# EAGLE design flowerfriend_rev3 (EAGLE 7.2.0)
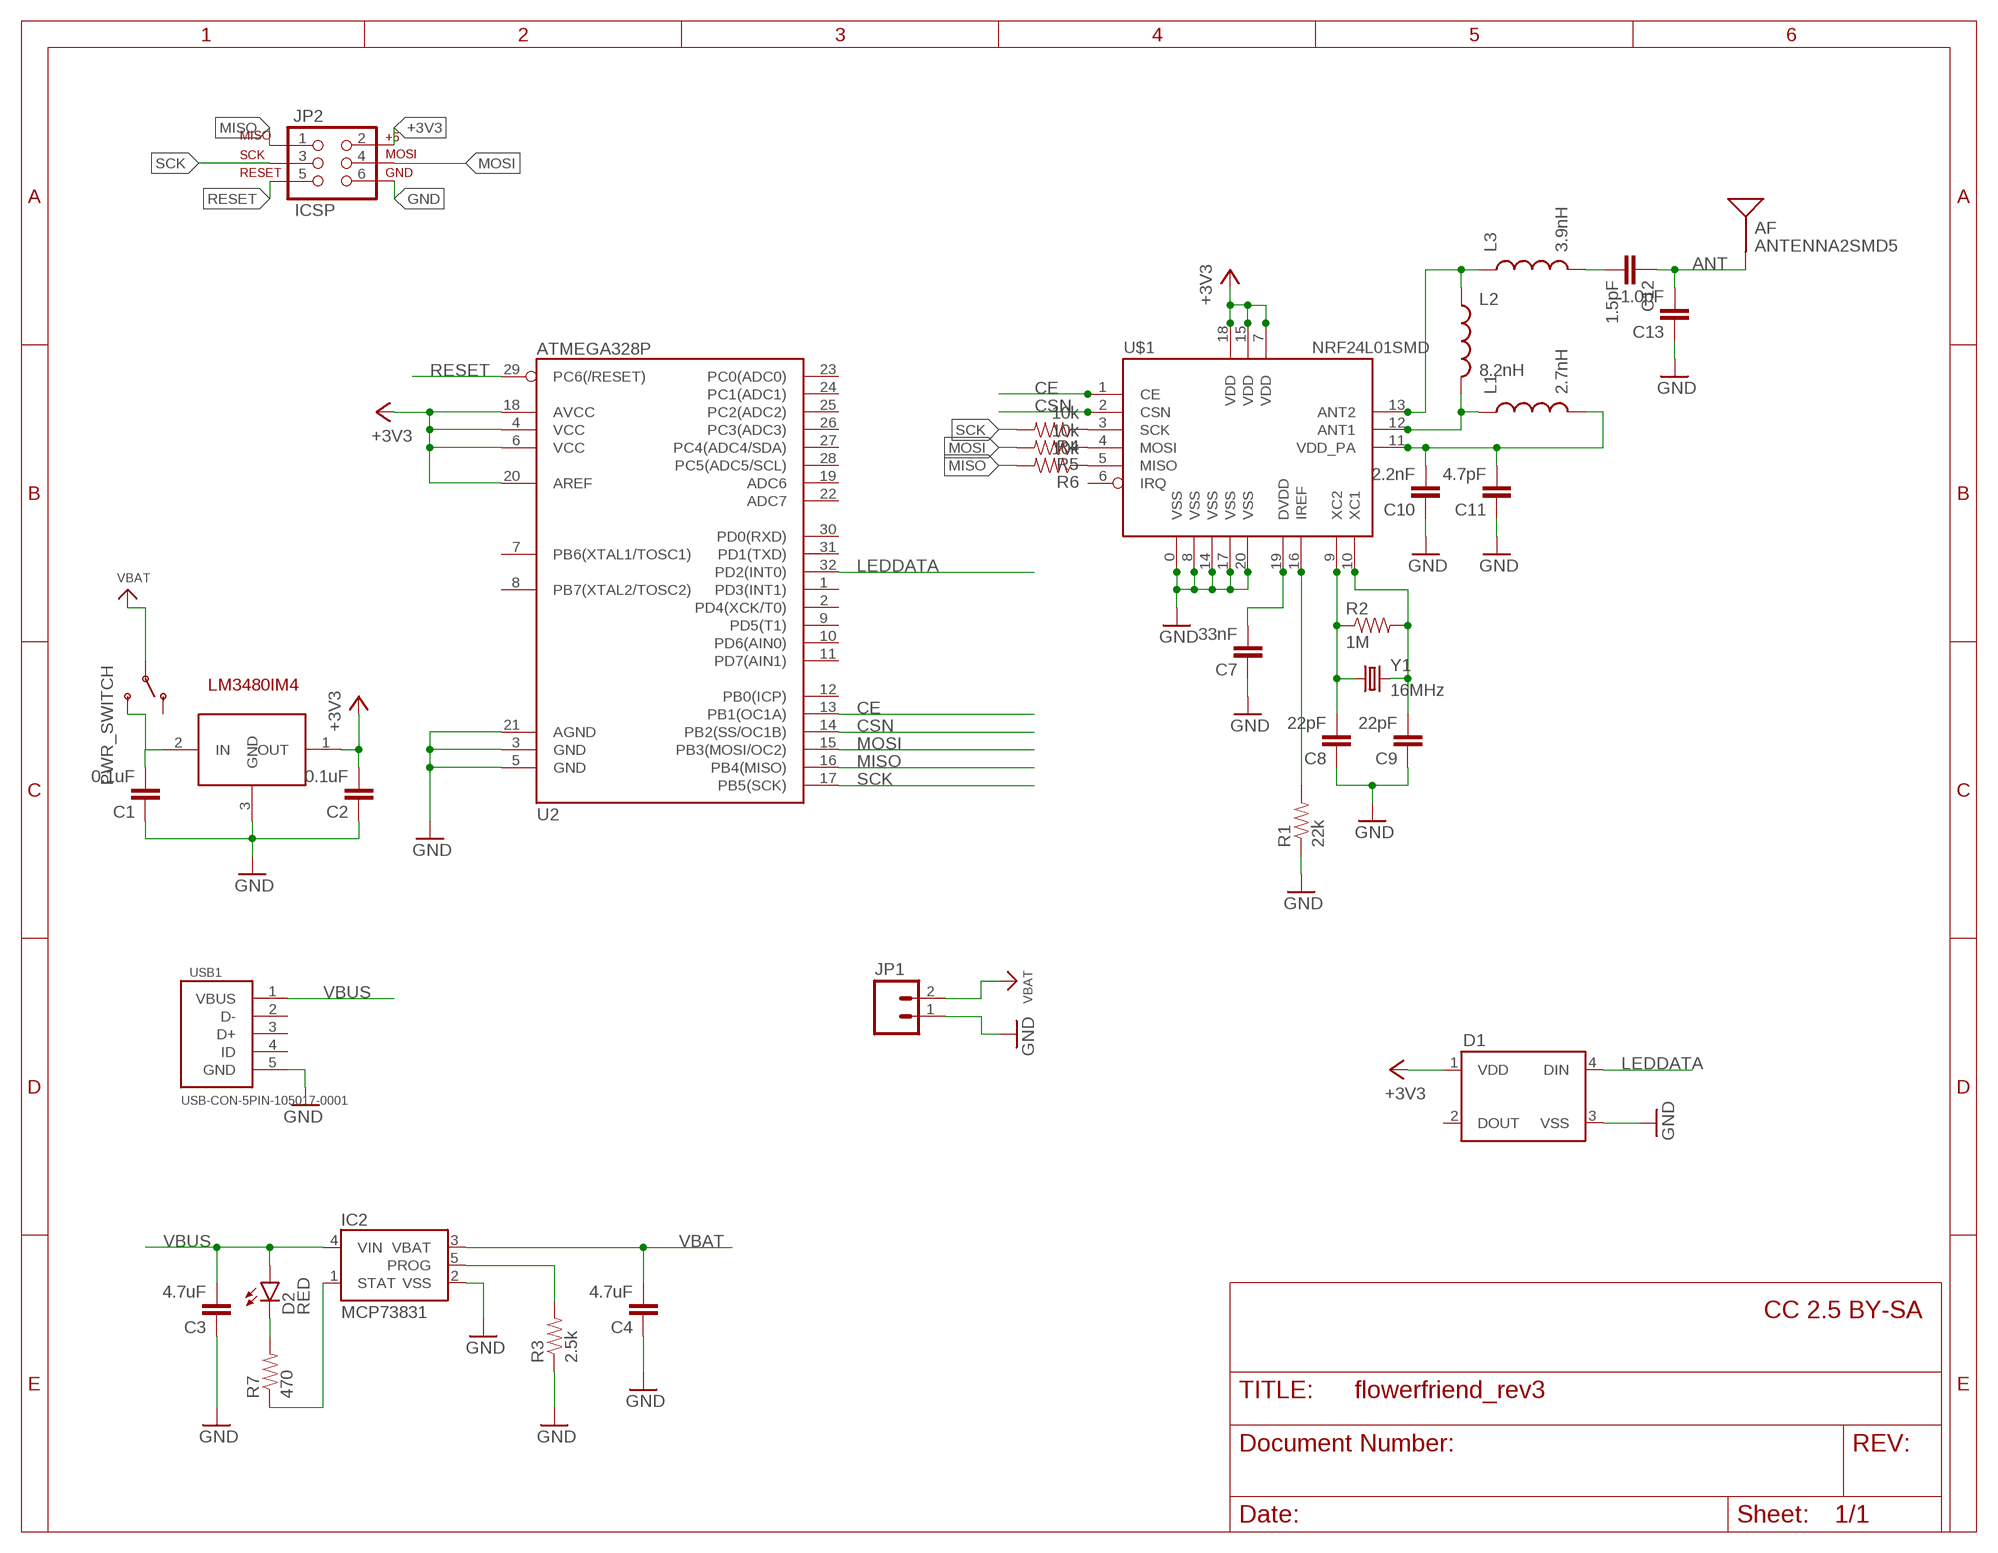
[diagram p0: schematic, sheet 1]

## Parts
AF  ANTENNA2SMD5  [ANTENNA-CHIP5]
C1  0.1uF  CAP0805  [0805]
C2  0.1uF  CAP0805  [0805]
C3  4.7uF  CAP0805  [0805]
C4  4.7uF  CAP0805  [0805]
C7  33nF  CAP0805  [0805]
C8  22pF  CAP0805  [0805]
C9  22pF  CAP0805  [0805]
C10  2.2nF  CAP0805  [0805]
C11  4.7pF  CAP0805  [0805]
C12  1.5pF  CAP0805  [0805]
C13  1.0pF  CAP0805  [0805]
D1  WS2812B  [WS2812B]
D2  RED  LED-RED0603  [LED-0603]
IC1  LM3480IM4  [SOT23-3]
IC2  MCP73831  [SOT23-5]
JP1  M02PTH  [1X02]
JP2  ICSP  AVR_SPI_PRG_6PTH  [2X3]
L1  2.7nH  INDUCTOR0805  [0805]
L2  8.2nH  INDUCTOR0805  [0805]
L3  3.9nH  INDUCTOR0805  [0805]
PWR_SWITCH  SWITCH_SPDT  [KPS-1290]
R1  22k  RESISTOR0805-RES  [0805]
R2  1M  RESISTOR0805-RES  [0805]
R3  2.5k  RESISTOR0805-RES  [0805]
R4  10k  RESISTOR0805-RES  [0805]
R5  10k  RESISTOR0805-RES  [0805]
R6  10k  RESISTOR0805-RES  [0805]
R7  470  RESISTOR0805-RES  [0805]
U2  ATMEGA328P  ATMEGA328_SMT  [TQFP32-08]
U$1  NRF24L01SMD  [QFN20]
USB1  USB-CON-5PIN-105017-0001  [USB-MICRO-MOLEX-105017-0001]
Y1  16MHz  CRYSTAL5X3  [CRYSTAL-SMD-5X3]

## Nets
+3V3 [power]: C2.2 D1.1(VDD) IC1.1(OUT) JP2.2 U2.4(VCC) U2.6(VCC) U2.18(AVCC) U2.20(AREF) U$1.7(VDD) U$1.15(VDD) U$1.18(VDD)
ANT: AF.FEED(SIGNAL) C12.1 C13.2
CE: U2.13(PB1(OC1A)) U$1.1(CE)
CSN: U2.14(PB2(SS/OC1B)) U$1.2(CSN)
GND [power]: C1.1 C2.1 C3.1 C4.1 C7.1 C8.1 C9.1 C10.1 C11.1 C13.1 D1.3(VSS) IC1.3(GND) IC2.2(VSS) JP1.1 JP2.6 R1.1 R3.1 U2.3(GND) U2.5(GND) U2.21(AGND) U$1.0(VSS) U$1.8(VSS) U$1.14(VSS) U$1.17(VSS) U$1.20(VSS) USB1.5(GND)
LEDDATA: D1.4(DIN) U2.32(PD2(INT0))
MISO: JP2.1 R6.2 U2.16(PB4(MISO))
MOSI: JP2.4 R5.2 U2.15(PB3(MOSI/OC2))
N$1: IC2.5(PROG) R3.2
N$4: C8.2 R2.1 U$1.9(XC2) Y1.1
N$5: C9.2 R2.2 U$1.10(XC1) Y1.3
N$6: R4.1 U$1.3(SCK)
N$7: R5.1 U$1.4(MOSI)
N$8: L2.1 L3.1 U$1.13(ANT2)
N$9: C10.2 C11.2 L1.2 U$1.11(VDD_PA)
N$10: R1.2 U$1.16(IREF)
N$11: C7.2 U$1.19(DVDD)
N$12: L1.1 L2.2 U$1.12(ANT1)
N$13: C12.2 L3.2
N$14: R6.1 U$1.5(MISO)
N$15 [power]: C1.2 IC1.2(IN) PWR_SWITCH.S
N$16: D2.C R7.2
N$17: IC2.1(STAT) R7.1
RESET: JP2.5 U2.29(PC6(/RESET))
SCK: JP2.3 R4.2 U2.17(PB5(SCK))
VBAT [power]: C4.2 IC2.3(VBAT) JP1.2 PWR_SWITCH.P
VBUS: C3.2 D2.A IC2.4(VIN) USB1.1(VBUS)
Unconnected: D1.2(DOUT) PWR_SWITCH.O U2.1(PD3(INT1)) U2.2(PD4(XCK/T0)) U2.7(PB6(XTAL1/TOSC1)) U2.8(PB7(XTAL2/TOSC2)) U2.9(PD5(T1)) U2.10(PD6(AIN0)) U2.11(PD7(AIN1)) U2.12(PB0(ICP)) U2.19(ADC6) U2.22(ADC7) U2.23(PC0(ADC0)) U2.24(PC1(ADC1)) U2.25(PC2(ADC2)) U2.26(PC3(ADC3)) U2.27(PC4(ADC4/SDA)) U2.28(PC5(ADC5/SCL)) U2.30(PD0(RXD)) U2.31(PD1(TXD)) U$1.6(IRQ) USB1.2(D-) USB1.3(D+) USB1.4(ID)

## Notes on the sheet
- CC 2.5 BY-SA

## Library data of the parts
AF = SparkFun-RF:ANTENNA2: Chip antenna Single endded antenna. Common with smaller chip antennas. CHIP4 package is the GPS Chip Antenna SKU: GPS-08418. CHIP5 package is 2.4GHz chip antenna SKU: WRL-00144.
C1-C4 C7-C13 = SparkFun-Passives:CAP: Capacitor Standard 0603 ceramic capacitor, and 0.1" leaded capacitor.
D1 = SparkFun-LED:WS2812B: WS2812B - Intelligent control LED integrated light source Technical Specifications: Power Supply Voltage (VDD): 3.5 to 5.3 V Input Voltage (VI): -0.5 to VDD+0.5 V Operating Junction Temperature (Topt): -25°C to +80°C Storage Temperature Range (Tstg): -55°C to +150°C; PROD_ID: DIO-12503
D2 = SparkFun-LED:LED-RED: Assorted Red LEDs LilyPad 1206- DIO-09912 1206- DIO-00809 0603- DIO-00819 "SMART" means more efficient and expensive; PROD_ID: DIO-00819
IC1 = SparkFun-PowerIC:LM3480IM4: Small package linear regulator
IC2 = SparkFun-PowerIC:MCP73831: Miniature single cell, fully integrated Li-Ion, Li-polymer charge management controller http://ww1.microchip.com/downloads/en/DeviceDoc/20001984g.pdf IC-09995; PROD_ID: IC-09995
JP1 = SparkFun-Connectors:M02: Standard 2-pin 0.1" header. Use with - straight break away headers ( PRT-00116) - right angle break away headers (PRT-00553) - swiss pins (PRT-00743) - machine pins (PRT-00117) - female headers (PRT-00115) Molex polarized connector foot print use with: PRT-08233 with associated crimp pins and housings. 2.54_SCREWTERM for use with PRT-10571. 3.5mm Screw Terminal footprints for PRT-08084 5mm Screw Terminal footprints for use with PRT-08432
JP2 = SparkFun-Connectors:AVR_SPI_PRG_6: AVR ISP 6 Pin This is the reduced ISP connector for AVR programming. Common on Arduino. This footprint will take up less PCB space and can be used with a 10-pin to 6-pin adapter such as SKU: BOB-08508 **Special note about "TEST_POINT" package. The stop mask is on the top side, so if you want your programming test points to be on the bottom of your board, make sure to place this package on the bottom side of the board. This also ensure that the orientation to program from the bottom side will be correct.
L1-L3 = SparkFun-Passives:INDUCTOR: Inductors Basic Inductor/Choke - 0603 and 1206. Footprints are not proven and vary greatly between part numbers. SRN6045- 33uH, 20% 1.4A SDR0403-560KL - 56uH, 10%, 500mA RMS/740mA peak
PWR_SWITCH = SparkFun-Electromechanical:SWITCH_SPDT: SWCH-10651 Side-actuated SPDT slide switch, as used on the Arduino Pro; PROD_ID: SWCH-10651
R1-R7 = SparkFun-Passives:RESISTOR: Resistor Basic schematic elements and footprints for 0603, 1206, and PTH resistors.
U2 = SparkFun-DigitalIC:ATMEGA328_SMT: 32-Pin Atmega328 part Commonly used on Arduino compatible boards Available in QFP and QFN packages TQFP is IC-09069 QFN is non-stock; PROD_ID: IC-09069
U$1 = SparkFun-RF:NRF24L01: 2.4GHz Low Power Transceiver This is the very popular, low cost, very low power RF transceiver from Nordic Semiconductor. Simple SPI interface. SKU: COM-00690
USB1 = GeekAmmo:USB-CON-5PIN: Molex Micro USB 105017-0001
Y1 = SparkFun-FreqCtrl:CRYSTAL: Various standard crystals. Proven footprints.; PROD_ID: XTAL-08218

## Net classes
1 power: width 0.305 mm

## Board
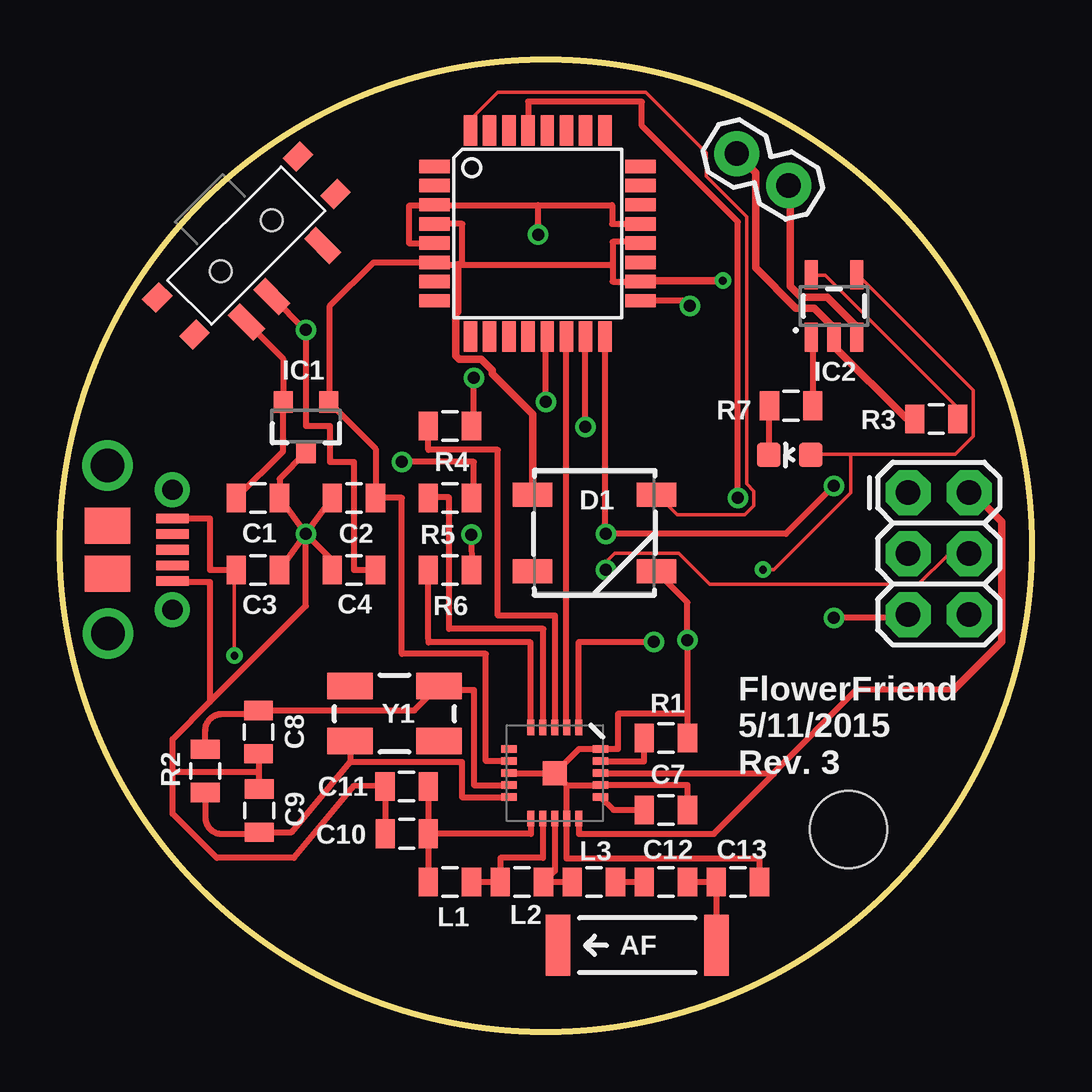
[diagram p1: board, top side]
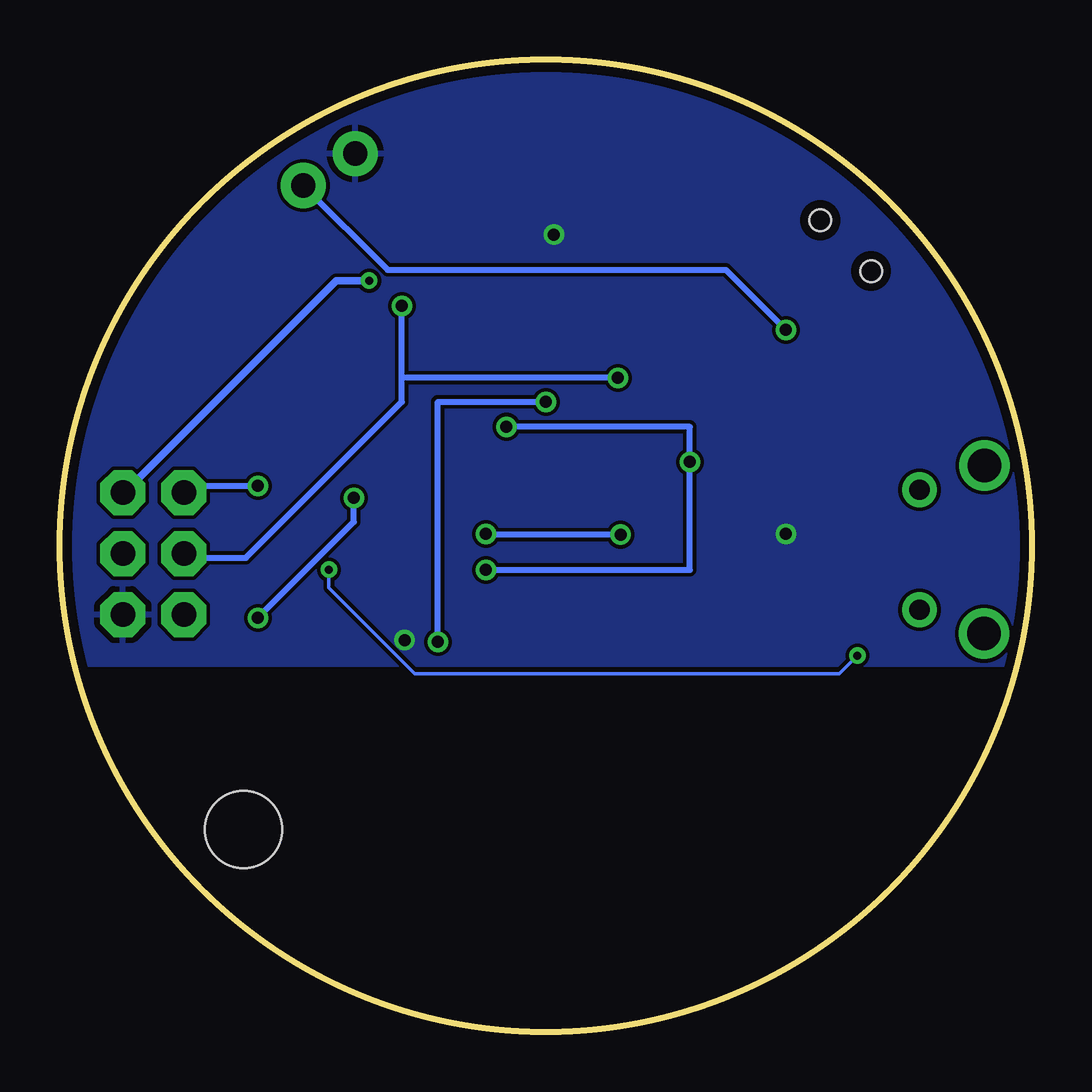
[diagram p2: board, bottom side, seen from below]

Size 40.5 x 40.5 mm. Coordinates in mm from the lower left corner, seen from the top.
Outline: circle at 20.25,20.25 radius 20.25
Copper layers (1*16): Top 0.0356mm / dielectric 1.5011mm / Bottom 0.0356mm
Design rules "LaenPCBOrder *": minimum track width 6mil, minimum drill 13mil, track to track 6mil, track to pad 6mil, pad to pad 6mil, via to via 6mil, smd to smd 6mil, copper to edge 15mil, drill to drill 6mil, minimum pad ring 7mil, minimum via ring 7mil, stop-mask expansion 3mil, vias tented up to drill 0mil, thermal gap 10mil
Holes 3.2 mm at 32.85,8.43

### Footprints (pad centres in the part's own frame; a part is rotated, then mirrored left to right if it is on the bottom)
ANTENNA-CHIP5 = smd 1.016 x 2.54: FEED -3.302,0; NC 3.302,0
0805 = smd 0.8 x 1.2: 1 -0.9,0; 2 0.9,0
WS2812B = smd 1.651 x 1: 1 -2.577,1.6; 2 -2.577,-1.6; 3 2.577,-1.6; 4 2.577,1.6
LED-0603 = smd 1 x 1: A 0,-0.877; C 0,0.877
SOT23-3 = smd 0.8 x 0.9: 1 -0.95,-1; 2 0.95,-1; 3 0,1.1
SOT23-5 = smd 0.55 x 1.2: 1 -0.95,-1.3; 2 0,-1.3; 3 0.95,-1.3; 4 0.95,1.3; 5 -0.95,1.3
1X02 = drill 1.016 pad 1.88: 1 0,0; 2 2.54,0
2X3 = drill 1.016 pad 1.88 octagon: 1 0,0; 2 0,2.54; 3 2.54,0; 4 2.54,2.54; 5 5.08,0; 6 5.08,2.54
KPS-1290 = smd 0.7 x 1.5: O -2.25,2.25; P 0.75,2.25; S 2.25,2.25 | smd 1 x 0.8: P$1 -4.15,1.1; P$2 -4.15,-1.1; P$3 4.15,-1.1; P$4 4.15,1.1 | hole 0.9: -1.5,0; 1.5,0
TQFP32-08 = smd 1.27 x 0.559: 1 -4.293,2.8; 2 -4.293,2; 3 -4.293,1.2; 4 -4.293,0.4; 5 -4.293,-0.4; 6 -4.293,-1.2; 7 -4.293,-2; 8 -4.293,-2.8; 17 4.293,-2.8; 18 4.293,-2; 19 4.293,-1.2; 20 4.293,-0.4; 21 4.293,0.4; 22 4.293,1.2; 23 4.293,2; 24 4.293,2.8 | smd 0.559 x 1.27: 9 -2.8,-4.293; 10 -2,-4.293; 11 -1.2,-4.293; 12 -0.4,-4.293; 13 0.4,-4.293; 14 1.2,-4.293; 15 2,-4.293; 16 2.8,-4.293; 25 2.8,4.293; 26 2,4.293; 27 1.2,4.293; 28 0.4,4.293; 29 -0.4,4.293; 30 -1.2,4.293; 31 -2,4.293; 32 -2.8,4.293
QFN20 = smd 1 x 1: 0 0,0 | smd 0.65 x 0.3: 1 -1.9,1; 2 -1.9,0.5; 3 -1.9,0; 4 -1.9,-0.5; 5 -1.9,-1; 11 1.9,-1; 12 1.9,-0.5; 13 1.9,0; 14 1.9,0.5; 15 1.9,1 | smd 0.3 x 0.65: 6 -1,-1.9; 7 -0.5,-1.9; 8 0,-1.9; 9 0.5,-1.9; 10 1,-1.9; 16 1,1.9; 17 0.5,1.9; 18 0,1.9; 19 -0.5,1.9; 20 -1,1.9
USB-MICRO-MOLEX-105017-0001 = smd 0.4 x 1.35: 1 1.2,0; 2 1.85,0; 3 2.5,0; 4 3.15,0; 5 3.8,0 | drill 0.85 pad 1.45: P$1 0,0; P$2 5,0 | smd 1.5 x 1.9: P$3 3.5,-2.7; P$4 1.5,-2.7 | drill 1.4: P$5 -1.004,-2.701; P$6 5.999,-2.69
CRYSTAL-SMD-5X3 = smd 1.9 x 1.1: 1 -1.85,-1.15; 2 1.85,-1.15; 3 1.85,1.15; 4 -1.85,1.15

### Placement (x,y rotation side)
AF  24.05,3.61 180 top
C1  8.25,22.25 180 top
C2  12.25,22.25 0 top
C3  8.25,19.25 180 top
C4  12.25,19.25 0 top
C7  25.25,12.25 180 top
C8  8.27,12.49 90 top
C9  8.3,9.22 270 top
C10  14.45,8.26 0 top
C11  14.45,10.23 0 top
C12  25.25,6.25 180 top
C13  28.25,6.25 180 top
D1  22.27,20.79 0 top
D2  30.41,24.04 90 top
IC1  10.25,25.25 180 top
IC2  32.25,30.25 0 top
JP1  28.2,36.6 328.4 top
JP2  35.34,22.47 270 top
L1  16.25,6.25 180 top
L2  19.25,6.25 180 top
L3  22.25,6.25 0 top
PWR_SWITCH  7.76,32.76 225 top
R1  25.25,9.25 180 top
R2  6.06,10.87 270 top
R3  36.51,25.54 0 top
R4  16.25,25.25 0 top
R5  16.25,22.25 0 top
R6  16.25,19.25 0 top
R7  30.46,26.09 180 top
U2  19.9,33.27 0 top
U$1  20.61,10.79 270 top
USB1  4.68,22.59 270 top
Y1  13.94,13.26 180 top

### Tracks (layer width: path | path; a pad name or v marks a point on that pad's centre or on a via)
+3V3  (via drill 0.33)
  Top 0.254: U$1.15 21.61,8.25 27.25,8.25 29.75,10.75 29.71,10.79 | U$1.18 29.71,10.79 | U$1.7 17.75,11.29 17.75,15.75 14.25,15.75 14.25,22.25 C2.2 13.15,24.3 IC1.1 11.25,26.3 11.25,30.25 13.07,32.07 U2.6 15.61,31.97 16.57,31.97 16.76,31.97 | 16.76,31.97 16.76,33.67 U2.4 | U2.20 24.19,32.92 23.03,32.92 23.03,31.97 | 23.03,31.97 23.03,31.27 U2.18 | 16.76,31.97 23.03,31.97 | 37.25,14.25 33.17,14.25 29.71,10.79
  Top 0.305: 16.57,31.97 16.57,30.01 16.49,29.93 16.49,28.18 16.64,28.02 17.56,28.02 18.01,27.57 18.01,27.42 19.69,25.74 19.69,22.46 D1.1 | v27.62,31.3 24.26,31.3 U2.18 | 37.25,14.25 39.25,16.25 39.25,21.25 38.25,22.25 JP2.2
  Bottom 0.305: v27.62,31.3 28.99,31.3 37.83,22.46 JP2.2
ANT
  Top 0.254: C12.1 C13.2 AF.FEED
CE  (via drill 0.5 pad 0.25)
  Top 0.254: U$1.1 21.61,16.25 v24.75,16.25 | v20.25,26.25 20.25,28.97 U2.13
  Bottom 0.254: v24.75,16.25 24.75,26.25 v20.25,26.25
CSN
  Top 0.254: U$1.2 21.1,12.7 U2.14
GND  (via drill 0.5 pad 0.25)
  Top 0.254: 21.11,10.29 U$1.14 21.11,7.22 29.15,7.22 C13.1 | U$1.8 U$1.0 | U$1.0 21.11,10.29 | 21.11,10.29 U$1.17 26.15,10.29 R1.1 | U$1.0 21.61,11.79 U$1.20 23.25,11.79 23.25,13.25 26.15,13.25 | C10.1 C11.1 12.25,10.25 9.75,7.25 6.54,7.25 4.69,9.09 4.69,10.82 | C7.1 26.15,13.25 | 26.15,13.25 26.15,16.32 v26.14,16.33 26.14,17.9 D1.3 | C8.1 8.3,11.59 C9.1 8.3,10.82 4.69,10.82 | 4.69,10.82 4.69,12.19 6.25,13.75 | 6.25,13.75 10.25,17.75 v10.25,20.75 | 19.92,34.45 15.62,34.45 U2.3 15.61,34.42 14.54,34.42 14.54,32.87 U2.5 | 19.92,34.45 23.01,34.45 23.01,33.67 U2.21 | USB1.5 4.68,18.75 6.25,18.75 6.25,13.75 | C2.1 v10.25,20.75 | v10.25,20.75 C1.1 9.15,23.05 IC1.3 | C3.1 v10.25,20.75 | v10.25,20.75 11.35,19.65 C4.1 | v19.92,33.22 19.92,34.45
  Top 0.305: R3.1 35.54,25.59 35.24,25.59 32.26,28.56 32.26,28.94 IC2.2 32.26,29.09 32.26,29.32 31.43,30.16 30.66,30.16 28.99,31.83 28.99,35.8 28.23,36.56 JP1.1
  pour Bottom: 41.25,15.25 -0.75,15.25 -0.75,41.25 41.25,41.25
LEDDATA
  Top 0.152: U2.32 17.18,37.63 17.18,38.08 18.24,39.15 24.42,39.15 26.93,36.64 26.93,35.64 28.61,33.97 28.61,22.84 28.91,22.54 28.91,21.93 28.53,21.55 25.71,21.55 24.87,22.39 D1.4
MISO  (via drill 0.5 pad 0.25)
  Top 0.254: U2.16 22.7,20.75 v22.75,20.75 30.25,20.75 v32.25,22.75 | v17.14,20.72 R6.2
  Bottom 0.254: 22.75,20.77 v22.75,20.75 22.75,20.72 v17.14,20.72 | JP2.1 35.06,22.75 v32.25,22.75
MOSI  (via drill 0.5 pad 0.25)
  Top 0.1: 22.75,19.53 v22.75,19.25
  Top 0.152: JP2.4 37.83,19.87 36.99,19.87 35.77,18.65 27.08,18.65 25.79,19.95 23.12,19.95 22.74,19.57 v22.75,19.25
  Top 0.254: R5.2 17.25,22.35 17.25,23.75 v14.25,23.75 | v21.89,25.21 U2.15
  Bottom 0.254: v21.89,25.21 14.25,25.21 v14.25,23.75 14.25,19.25 v22.75,19.25
N$1
  Top 0.152: R3.2 37.37,25.59 37.37,26.04 31.88,31.53 31.35,31.53 IC2.5
N$4
  Top 0.254: U$1.9 17.25,10.29 17.25,14.25 15.79,14.25 Y1.1 14.77,13.39 C8.2 arc-90 8.13,13.25 6.75,13.25 arc90 6.06,12.56 R2.1
N$5
  Top 0.254: Y1.3 12.09,11.25 | 12.09,11.25 16.75,11.25 16.75,9.79 U$1.10 | 8.2,8.32 C9.2 | C9.2 9.66,8.32 12.09,11.25 | R2.2 6.06,8.94 arc90 6.75,8.25 8.22,8.25 arc90 C9.2
N$6
  Top 0.254: U$1.3 20.63,12.69 20.63,17.34 18.25,17.34 18.25,24.25 15.35,24.25 R4.1
N$7
  Top 0.254: U$1.4 20.14,12.69 20.14,16.79 16.21,16.79 16.21,22.27 15.35,22.27 R5.1
N$8
  Top 0.254: U$1.13 20.61,6.71 L2.1 L3.1
N$9
  Top 0.254: U$1.11 19.61,8.25 C10.2 | C11.2 C10.2 | C10.2 L1.2
N$10
  Top 0.254: U$1.16 23.05,9.25 R1.2
N$11
  Top 0.254: U$1.19 22.51,11.27 24.34,11.27 C7.2
N$12
  Top 0.254: U$1.12 20.11,7.25 18.35,7.25 L2.2 L1.1
N$13
  Top 0.254: L3.2 C12.2
N$14
  Top 0.254: U$1.5 19.61,16.23 15.36,16.23 15.36,16.36 15.35,16.36 R6.1
N$15
  Top 0.254: C1.2 9.3,24.2 IC1.2 9.3,28.05 PWR_SWITCH.S
N$16
  Top 0.254: R7.2 29.53,26.06 D2.C
N$17
  Top 0.254: IC2.1 31.36,28.89 R7.1
RESET  (via drill 0.5 pad 0.25)
  Top 0.254: JP2.5 35.2,17.25 v32.25,17.25 | v28.25,22.25 28.25,33.75 24.25,37.75 24.25,38.75 24.23,38.76 19.5,38.76 U2.29
  Bottom 0.254: v32.25,17.25 28.25,21.25 v28.25,22.25
SCK  (via drill 0.5 pad 0.25)
  Top 0.254: R4.2 17.25,25.35 v17.25,27.25 | v26.25,30.25 26.03,30.47 U2.17
  Bottom 0.254: v17.25,27.25 26.25,27.25 | 26.25,27.25 v26.25,30.25 | JP2.3 35.16,19.75 32.75,19.75 26.25,26.25 26.25,27.25
VBAT  (via drill 0.5 pad 0.25)
  Top 0.254: C4.2 12.25,19.25 12.25,23.75 11.25,23.75 11.25,25.25 10.25,25.25 10.25,29.22 PWR_SWITCH.P
  Top 0.305: IC2.3 33.18,29.02 33.18,29.4 31.96,30.62 30.89,30.62 30.44,31.07 30.44,35.26 JP1.2 | v10.25,29.25 v10.24,29.24 10.25,29.22
  Bottom 0.254: JP1.2 26.84,31.75 12.75,31.75 v10.25,29.25
VBUS  (via drill 0.33)
  Top 0.152: 32.95,24.06 37.29,24.06 38.06,24.82 38.06,26.73 33.25,31.53 IC2.4 | 32.95,24.06 31.35,24.06 D2.A | v7.27,15.68 7.27,19.19 C3.2 | v29.29,19.26 29.75,19.26 32.95,22.46 32.95,24.06
  Top 0.254: USB1.1 6.25,21.4 6.25,19.25 C3.2
  Bottom 0.152: v7.27,15.68 8.03,14.92 25.71,14.92 29.29,18.5 v29.29,19.26

### Text on the board
tPlace: Y1 | FlowerFriend / 5/11/2015 / Rev. 3